# EAGLE design 8bitPig-PigstyGates_v2-mainPCB (EAGLE 9.2.2)
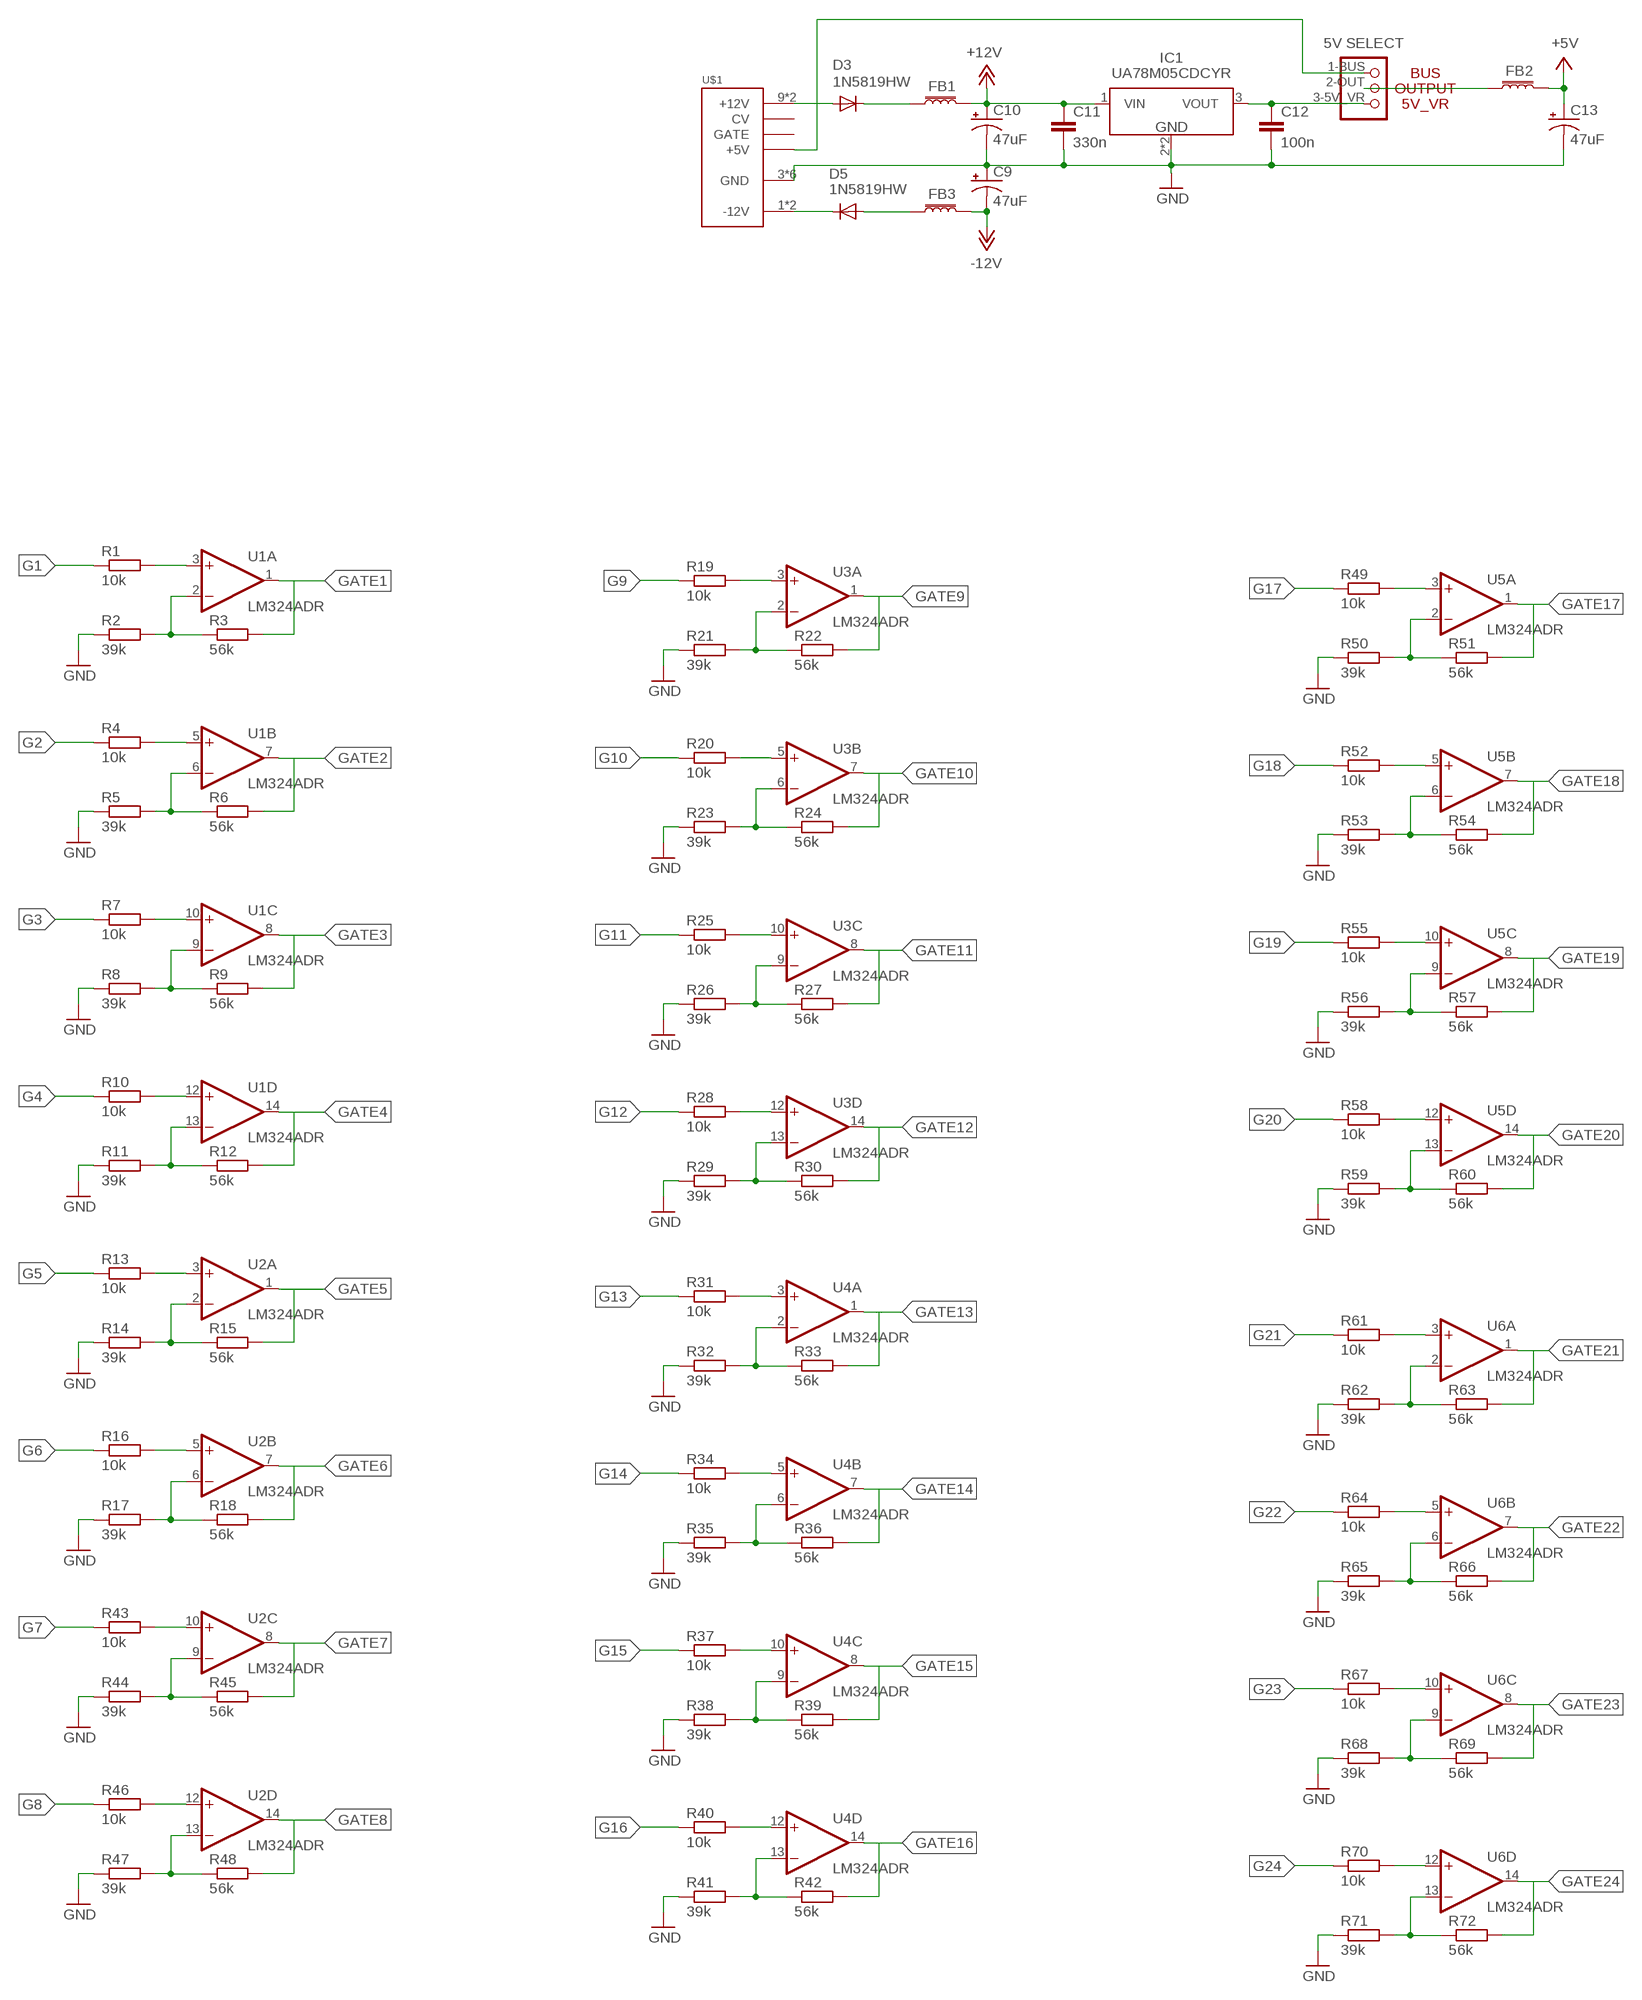
[diagram p0: schematic, sheet 1, part 1 of 2]
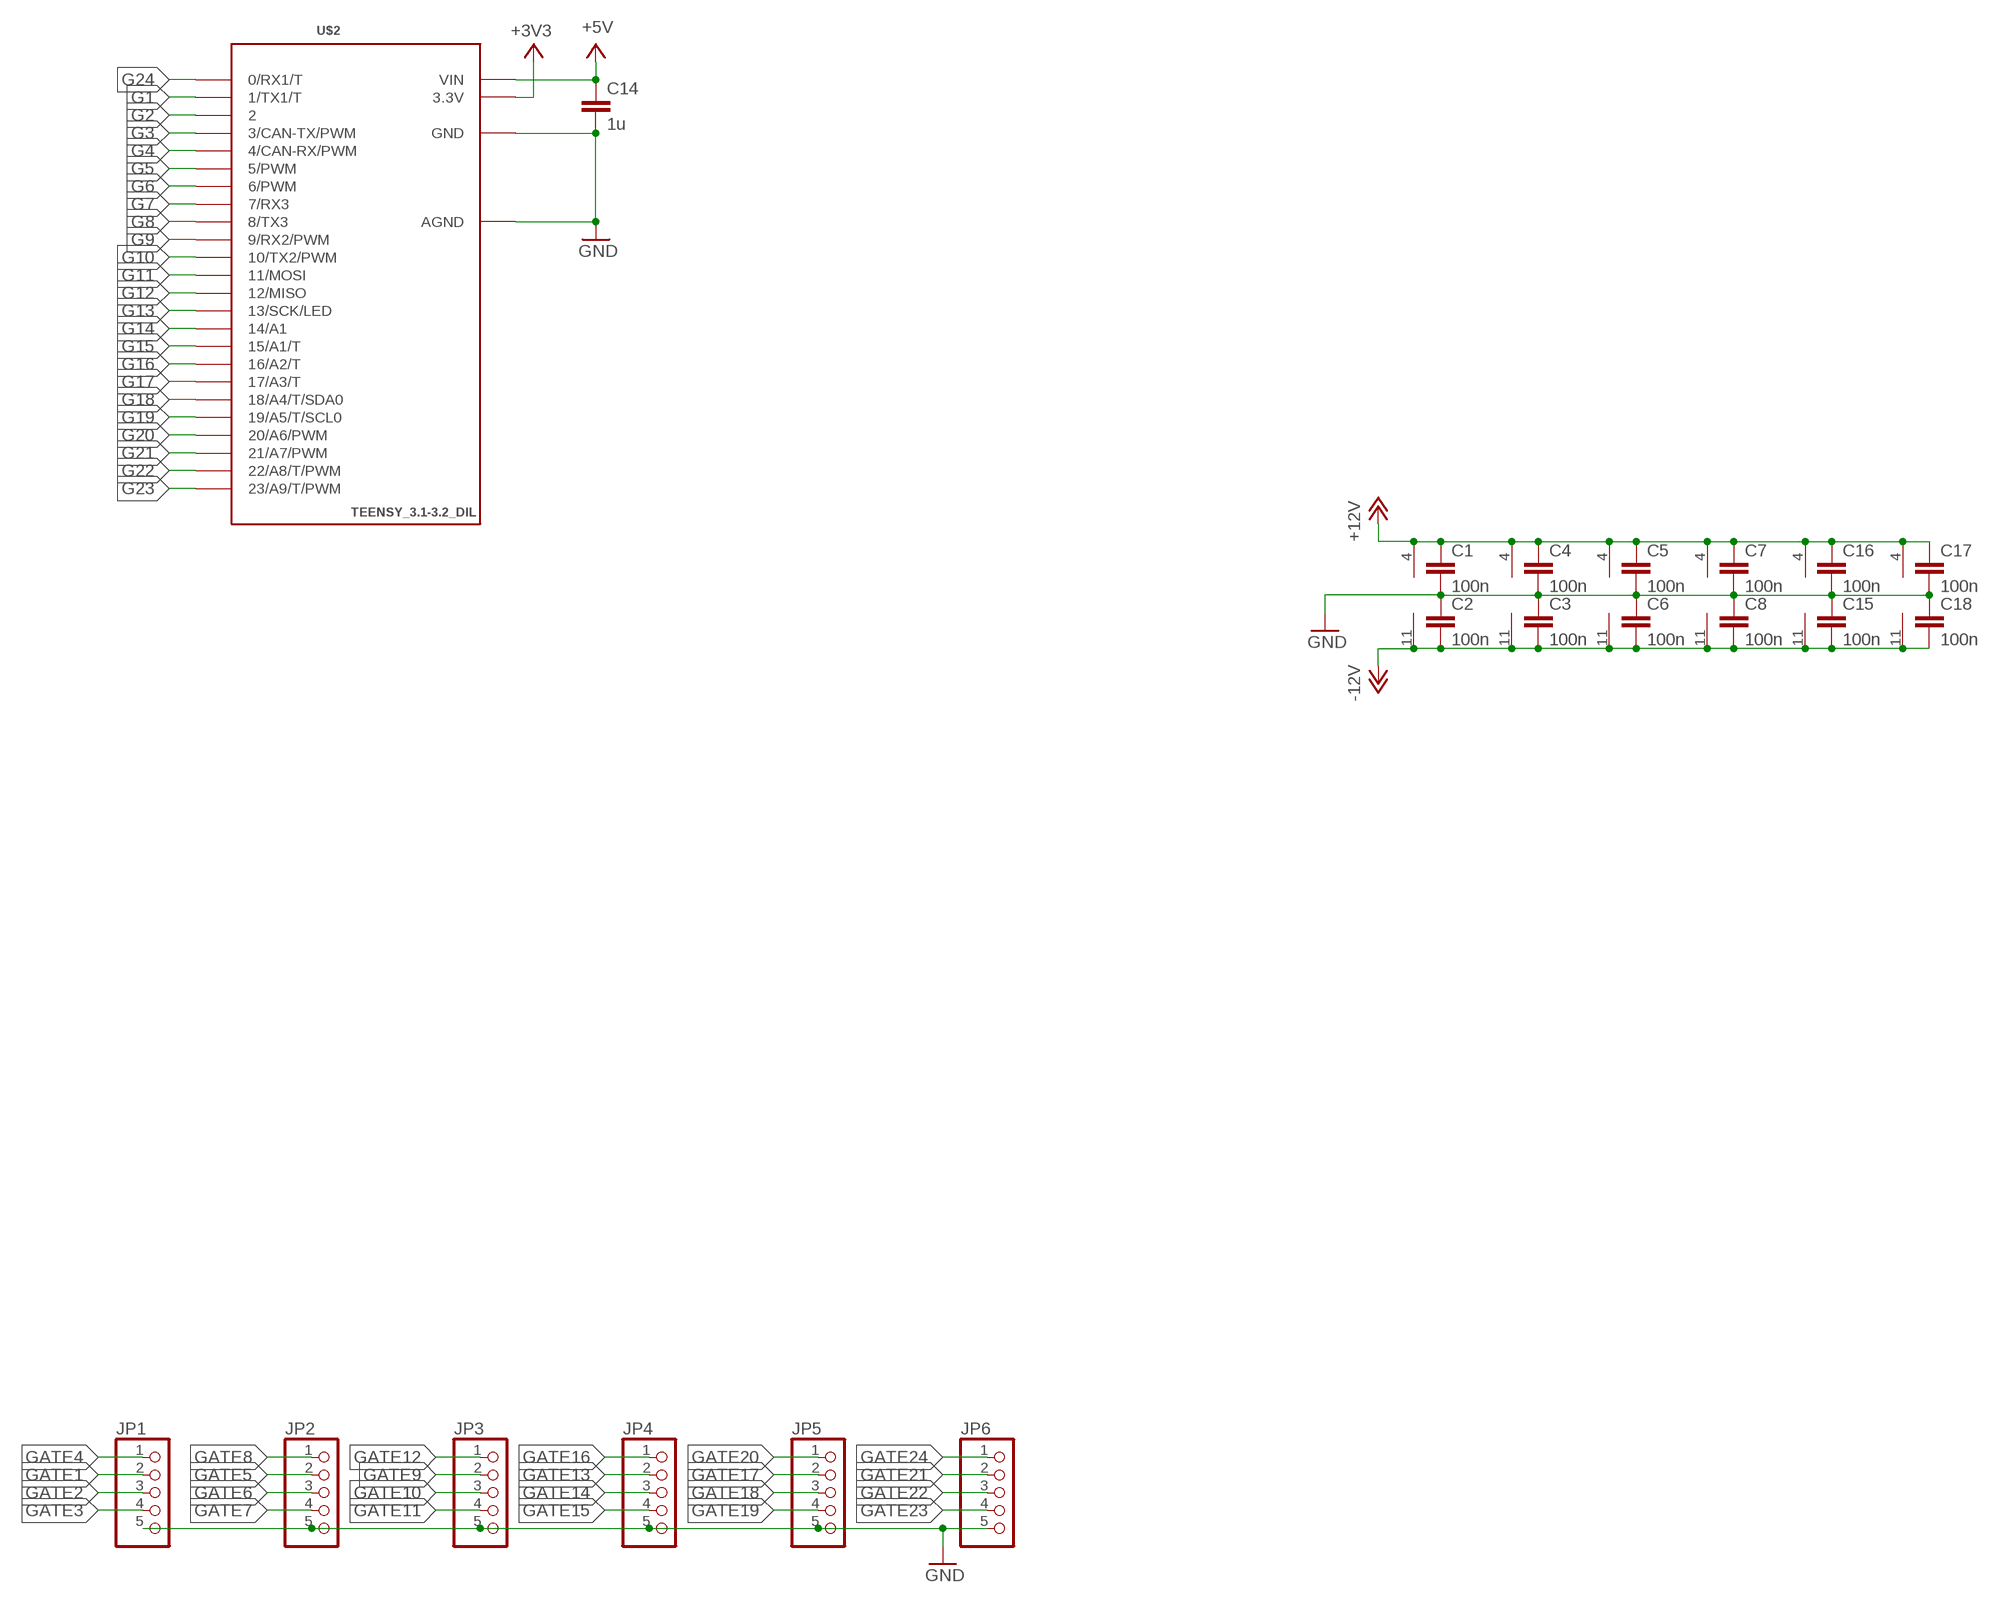
[diagram p1: schematic, sheet 1, part 2 of 2]

## Parts
C1  100n  C-EUC0603  [C0603]
C2  100n  C-EUC0603  [C0603]
C3  100n  C-EUC0603  [C0603]
C4  100n  C-EUC0603  [C0603]
C5  100n  C-EUC0603  [C0603]
C6  100n  C-EUC0603  [C0603]
C7  100n  C-EUC0603  [C0603]
C8  100n  C-EUC0603  [C0603]
C9  47uF  47UF-POLAR-PANASONIC_D-35V-20%  [PANASONIC_D]
C10  47uF  47UF-POLAR-PANASONIC_D-35V-20%  [PANASONIC_D]
C11  330n  C-EUC0603  [C0603]
C12  100n  C-EUC0603  [C0603]
C13  47uF  47UF-POLAR-PANASONIC_D-35V-20%  [PANASONIC_D]
C14  1u  C-EUC0603  [C0603]
C15  100n  C-EUC0603  [C0603]
C16  100n  C-EUC0603  [C0603]
C17  100n  C-EUC0603  [C0603]
C18  100n  C-EUC0603  [C0603]
D3  1N5819HW  DIODE_DIODE-SOD123  [DIODE_SOD123]
D5  1N5819HW  DIODE_DIODE-SOD123  [DIODE_SOD123]
FB1  30Ω/1.8A  FERRITE_BEAD-0603  [0603]
FB2  30Ω/1.8A  FERRITE_BEAD-0603  [0603]
FB3  30Ω/1.8A  FERRITE_BEAD-0603  [0603]
IC1  UA78M05CDCYR  [SOT230P700X180-4N]
JP1  PINHD-1X5  [1X05]
JP2  PINHD-1X5  [1X05]
JP3  PINHD-1X5  [1X05]
JP4  PINHD-1X5  [1X05]
JP5  PINHD-1X5  [1X05]
JP6  PINHD-1X5  [1X05]
JP_5V  SELECTOR_POWER  [SELECTOR_POWER]
R1  10k  R-EU_R0603  [R0603]
R2  39k  R-EU_R0603  [R0603]
R3  56k  R-EU_R0603  [R0603]
R4  10k  R-EU_R0603  [R0603]
R5  39k  R-EU_R0603  [R0603]
R6  56k  R-EU_R0603  [R0603]
R7  10k  R-EU_R0603  [R0603]
R8  39k  R-EU_R0603  [R0603]
R9  56k  R-EU_R0603  [R0603]
R10  10k  R-EU_R0603  [R0603]
R11  39k  R-EU_R0603  [R0603]
R12  56k  R-EU_R0603  [R0603]
R13  10k  R-EU_R0603  [R0603]
R14  39k  R-EU_R0603  [R0603]
R15  56k  R-EU_R0603  [R0603]
R16  10k  R-EU_R0603  [R0603]
R17  39k  R-EU_R0603  [R0603]
R18  56k  R-EU_R0603  [R0603]
R19  10k  R-EU_R0603  [R0603]
R20  10k  R-EU_R0603  [R0603]
R21  39k  R-EU_R0603  [R0603]
R22  56k  R-EU_R0603  [R0603]
R23  39k  R-EU_R0603  [R0603]
R24  56k  R-EU_R0603  [R0603]
R25  10k  R-EU_R0603  [R0603]
R26  39k  R-EU_R0603  [R0603]
R27  56k  R-EU_R0603  [R0603]
R28  10k  R-EU_R0603  [R0603]
R29  39k  R-EU_R0603  [R0603]
R30  56k  R-EU_R0603  [R0603]
R31  10k  R-EU_R0603  [R0603]
R32  39k  R-EU_R0603  [R0603]
R33  56k  R-EU_R0603  [R0603]
R34  10k  R-EU_R0603  [R0603]
R35  39k  R-EU_R0603  [R0603]
R36  56k  R-EU_R0603  [R0603]
R37  10k  R-EU_R0603  [R0603]
R38  39k  R-EU_R0603  [R0603]
R39  56k  R-EU_R0603  [R0603]
R40  10k  R-EU_R0603  [R0603]
R41  39k  R-EU_R0603  [R0603]
R42  56k  R-EU_R0603  [R0603]
R43  10k  R-EU_R0603  [R0603]
R44  39k  R-EU_R0603  [R0603]
R45  56k  R-EU_R0603  [R0603]
R46  10k  R-EU_R0603  [R0603]
R47  39k  R-EU_R0603  [R0603]
R48  56k  R-EU_R0603  [R0603]
R49  10k  R-EU_R0603  [R0603]
R50  39k  R-EU_R0603  [R0603]
R51  56k  R-EU_R0603  [R0603]
R52  10k  R-EU_R0603  [R0603]
R53  39k  R-EU_R0603  [R0603]
R54  56k  R-EU_R0603  [R0603]
R55  10k  R-EU_R0603  [R0603]
R56  39k  R-EU_R0603  [R0603]
R57  56k  R-EU_R0603  [R0603]
R58  10k  R-EU_R0603  [R0603]
R59  39k  R-EU_R0603  [R0603]
R60  56k  R-EU_R0603  [R0603]
R61  10k  R-EU_R0603  [R0603]
R62  39k  R-EU_R0603  [R0603]
R63  56k  R-EU_R0603  [R0603]
R64  10k  R-EU_R0603  [R0603]
R65  39k  R-EU_R0603  [R0603]
R66  56k  R-EU_R0603  [R0603]
R67  10k  R-EU_R0603  [R0603]
R68  39k  R-EU_R0603  [R0603]
R69  56k  R-EU_R0603  [R0603]
R70  10k  R-EU_R0603  [R0603]
R71  39k  R-EU_R0603  [R0603]
R72  56k  R-EU_R0603  [R0603]
U1  LM324ADR  TL074_SMD  [SO14]
U2  LM324ADR  TL074_SMD  [SO14]
U3  LM324ADR  TL074_SMD  [SO14]
U4  LM324ADR  TL074_SMD  [SO14]
U5  LM324ADR  TL074_SMD  [SO14]
U6  LM324ADR  TL074_SMD  [SO14]
U$1  POWER  [POWER_16]
U$2  TEENSY_3.1-3.2_DIL  [TEENSY_3.0-3.2&LC_DIL]

## Nets
+3V3: U$2.3.3V
+5V [pwr]: C13.+ C14.1 FB2.2 U$2.VIN
+12V [pwr]: C1.1 C4.1 C5.1 C7.1 C10.+ C11.1 C16.1 C17.1 FB1.2 IC1.1(VIN) U1.4(P:V+) U2.4(P:V+) U3.4(P:V+) U4.4(P:V+) U5.4(P:V+) U6.4(P:V+)
-12V [pwr]: C2.2 C3.2 C6.2 C8.2 C9.- C15.2 C18.2 FB3.2 U1.11(P:V-) U2.11(P:V-) U3.11(P:V-) U4.11(P:V-) U5.11(P:V-) U6.11(P:V-)
G1: R1.1 U$2.1(1/TX1/T)
G2: R4.1 U$2.2
G3: R7.1 U$2.3(3/CAN-TX/PWM)
G4: R10.1 U$2.4(4/CAN-RX/PWM)
G5: R13.1 U$2.5(5/PWM)
G6: R16.1 U$2.6(6/PWM)
G7: R43.1 U$2.7(7/RX3)
G8: R46.1 U$2.8(8/TX3)
G9: R19.1 U$2.9(9/RX2/PWM)
G10: R20.1 U$2.10(10/TX2/PWM)
G11: R25.1 U$2.11(11/MOSI)
G12: R28.1 U$2.12(12/MISO)
G13: R31.1 U$2.13(13/SCK/LED)
G14: R34.1 U$2.14/A0(14/A1)
G15: R37.1 U$2.15/A1(15/A1/T)
G16: R40.1 U$2.16/A2(16/A2/T)
G17: R49.1 U$2.17/A3(17/A3/T)
G18: R52.1 U$2.18/A4(18/A4/T/SDA0)
G19: R55.1 U$2.19/A5(19/A5/T/SCL0)
G20: R58.1 U$2.20/A6(20/A6/PWM)
G21: R61.1 U$2.21/A7(21/A7/PWM)
G22: R64.1 U$2.22/A8(22/A8/T/PWM)
G23: R67.1 U$2.23/A9(23/A9/T/PWM)
G24: R70.1 U$2.0(0/RX1/T)
GATE1: JP1.2 R3.2 U1.1(A:OUT)
GATE2: JP1.3 R6.2 U1.7(B:OUT)
GATE3: JP1.4 R9.2 U1.8(C:OUT)
GATE4: JP1.1 R12.2 U1.14(D:OUT)
GATE5: JP2.2 R15.2 U2.1(A:OUT)
GATE6: JP2.3 R18.2 U2.7(B:OUT)
GATE7: JP2.4 R45.2 U2.8(C:OUT)
GATE8: JP2.1 R48.2 U2.14(D:OUT)
GATE9: JP3.2 R22.2 U3.1(A:OUT)
GATE10: JP3.3 R24.2 U3.7(B:OUT)
GATE11: JP3.4 R27.2 U3.8(C:OUT)
GATE12: JP3.1 R30.2 U3.14(D:OUT)
GATE13: JP4.2 R33.2 U4.1(A:OUT)
GATE14: JP4.3 R36.2 U4.7(B:OUT)
GATE15: JP4.4 R39.2 U4.8(C:OUT)
GATE16: JP4.1 R42.2 U4.14(D:OUT)
GATE17: JP5.2 R51.2 U5.1(A:OUT)
GATE18: JP5.3 R54.2 U5.7(B:OUT)
GATE19: JP5.4 R57.2 U5.8(C:OUT)
GATE20: JP5.1 R60.2 U5.14(D:OUT)
GATE21: JP6.2 R63.2 U6.1(A:OUT)
GATE22: JP6.3 R66.2 U6.7(B:OUT)
GATE23: JP6.4 R69.2 U6.8(C:OUT)
GATE24: JP6.1 R72.2 U6.14(D:OUT)
GND [pwr]: C1.2 C2.1 C3.1 C4.2 C5.2 C6.1 C7.2 C8.1 C9.+ C10.- C11.2 C12.2 C13.- C14.2 C15.1 C16.2 C17.2 C18.1 IC1.2(GND) IC1.4(GND) JP1.5 JP2.5 JP3.5 JP4.5 JP5.5 JP6.5 R2.1 R5.1 R8.1 R11.1 R14.1 R17.1 R21.1 R23.1 R26.1 R29.1 R32.1 R35.1 R38.1 R41.1 R44.1 R47.1 R50.1 R53.1 R56.1 R59.1 R62.1 R65.1 R68.1 R71.1 U$1.3(GND) U$1.4(GND) U$1.5(GND) U$1.6(GND) U$1.7(GND) U$1.8(GND) U$2.AGND U$2.GND
N$1: R1.2 U1.3(A:+IN)
N$2: R2.2 R3.1 U1.2(A:-IN)
N$3: R4.2 U1.5(B:+IN)
N$4: R5.2 R6.1 U1.6(B:-IN)
N$5: R7.2 U1.10(C:+IN)
N$6: R8.2 R9.1 U1.9(C:-IN)
N$7: R10.2 U1.12(D:+IN)
N$8: R11.2 R12.1 U1.13(D:-IN)
N$9: D3.A U$1.9(+12V) U$1.10(+12V)
N$10: D5.C U$1.1(-12V) U$1.2(-12V)
N$11: D5.A FB3.1
N$12: D3.C FB1.1
N$13: JP_5V.1-BUS U$1.11(+5V) U$1.12(+5V)
N$14: C12.1 IC1.3(VOUT) JP_5V.3-5V_VR(3-VR)
N$15: FB2.1 JP_5V.2-OUT
N$16: R13.2 U2.3(A:+IN)
N$17: R19.2 U3.3(A:+IN)
N$18: R20.2 U3.5(B:+IN)
N$19: R21.2 R22.1 U3.2(A:-IN)
N$20: R23.2 R24.1 U3.6(B:-IN)
N$21: R25.2 U3.10(C:+IN)
N$22: R26.2 R27.1 U3.9(C:-IN)
N$23: R28.2 U3.12(D:+IN)
N$24: R29.2 R30.1 U3.13(D:-IN)
N$25: R31.2 U4.3(A:+IN)
N$26: R32.2 R33.1 U4.2(A:-IN)
N$27: R34.2 U4.5(B:+IN)
N$28: R35.2 R36.1 U4.6(B:-IN)
N$29: R37.2 U4.10(C:+IN)
N$30: R38.2 R39.1 U4.9(C:-IN)
N$31: R40.2 U4.12(D:+IN)
N$32: R41.2 R42.1 U4.13(D:-IN)
N$33: R14.2 R15.1 U2.2(A:-IN)
N$34: R16.2 U2.5(B:+IN)
N$35: R17.2 R18.1 U2.6(B:-IN)
N$36: R43.2 U2.10(C:+IN)
N$37: R44.2 R45.1 U2.9(C:-IN)
N$38: R46.2 U2.12(D:+IN)
N$39: R47.2 R48.1 U2.13(D:-IN)
N$40: R49.2 U5.3(A:+IN)
N$41: R50.2 R51.1 U5.2(A:-IN)
N$42: R52.2 U5.5(B:+IN)
N$43: R53.2 R54.1 U5.6(B:-IN)
N$44: R55.2 U5.10(C:+IN)
N$45: R56.2 R57.1 U5.9(C:-IN)
N$46: R58.2 U5.12(D:+IN)
N$47: R59.2 R60.1 U5.13(D:-IN)
N$48: R61.2 U6.3(A:+IN)
N$49: R62.2 R63.1 U6.2(A:-IN)
N$50: R64.2 U6.5(B:+IN)
N$51: R65.2 R66.1 U6.6(B:-IN)
N$52: R67.2 U6.10(C:+IN)
N$53: R68.2 R69.1 U6.9(C:-IN)
N$54: R70.2 U6.12(D:+IN)
N$55: R71.2 R72.1 U6.13(D:-IN)
Unconnected: U$1.13(CV) U$1.14(CV) U$1.15(GATE) U$1.16(GATE)

## Library data of the parts
C1-C8 C11 C12 C14-C18 = resistor:C-EU: CAPACITOR, European symbol
C9 C10 C13 = SparkFun-Capacitors:47UF-POLAR: 47µF polarized capacitors A capacitor is a passive two-terminal electrical component used to store electrical energy temporarily in an electric field.; PROD_ID: CAP-08478
D3 D5 = grids_v02:DIODE_DIODE-: DIODE
FB1-FB3 = SparkFun-Coils:FERRITE_BEAD: Ferrite Bead (blocks, cores, rings, chokes, etc.) Inductor with layers of ferrite used to suppress high frequencies. Often used to isolate high frequency noise. SparkFun Products: IOIO-OTG - V2.2 <https://www.sparkfun.com/products/13613> SparkFun SAMD21 Mini Breakout <https://www.sparkfun.com/products/13664> SparkFun 6 Degrees of Freedom Breakout - LSM6DS3 <https://www.sparkfun.com/products/13339> SparkFun SAMD21 Dev Breakout <https://www.sparkfun.com/products/13672>; PROD_ID: NDUC-07859
IC1 = SamacSys_Parts:UA78M05CDCYR: 500-mA, 25-V, Linear Voltage Regulators Source: Datasheet <http://www.ti.com/lit/gpn/ua78m>; DESCRIPTION: 500-mA, 25-V, Linear Voltage Regulators; HEIGHT: 1.8mm; MANUFACTURER_NAME: Texas Instruments; MANUFACTURER_PART_NUMBER: UA78M05CDCYR; MOUSER_PART_NUMBER: 595-UA78M05CDCYR; MOUSER_PRICE-STOCK: https://www.mouser.com/Search/Refine.aspx?Keyword=595-UA78M05CDCYR
JP1-JP6 = pinhead:PINHD-1X5: PIN HEADER
JP_5V = SchnitzelsComponents:SELECTOR_POWER: PIN HEADER
R1-R72 = resistor:R-EU_: RESISTOR, European symbol
U1-U6 = SchnitzelsComponents:TL074: Generic Quad Op Amp
U$1 = eurorack:POWER
U$2 = Teensy_3_and_LC_Series_Boards_v1.4:TEENSY_3.1-3.2_DIL: Teensy 3.1 or 3.2 in a DIL Layout.

## Net classes
0 default: width 0.152 mm, clearance 0.508 mm
1 pwr: width 0.305 mm, clearance 0.508 mm

## Board
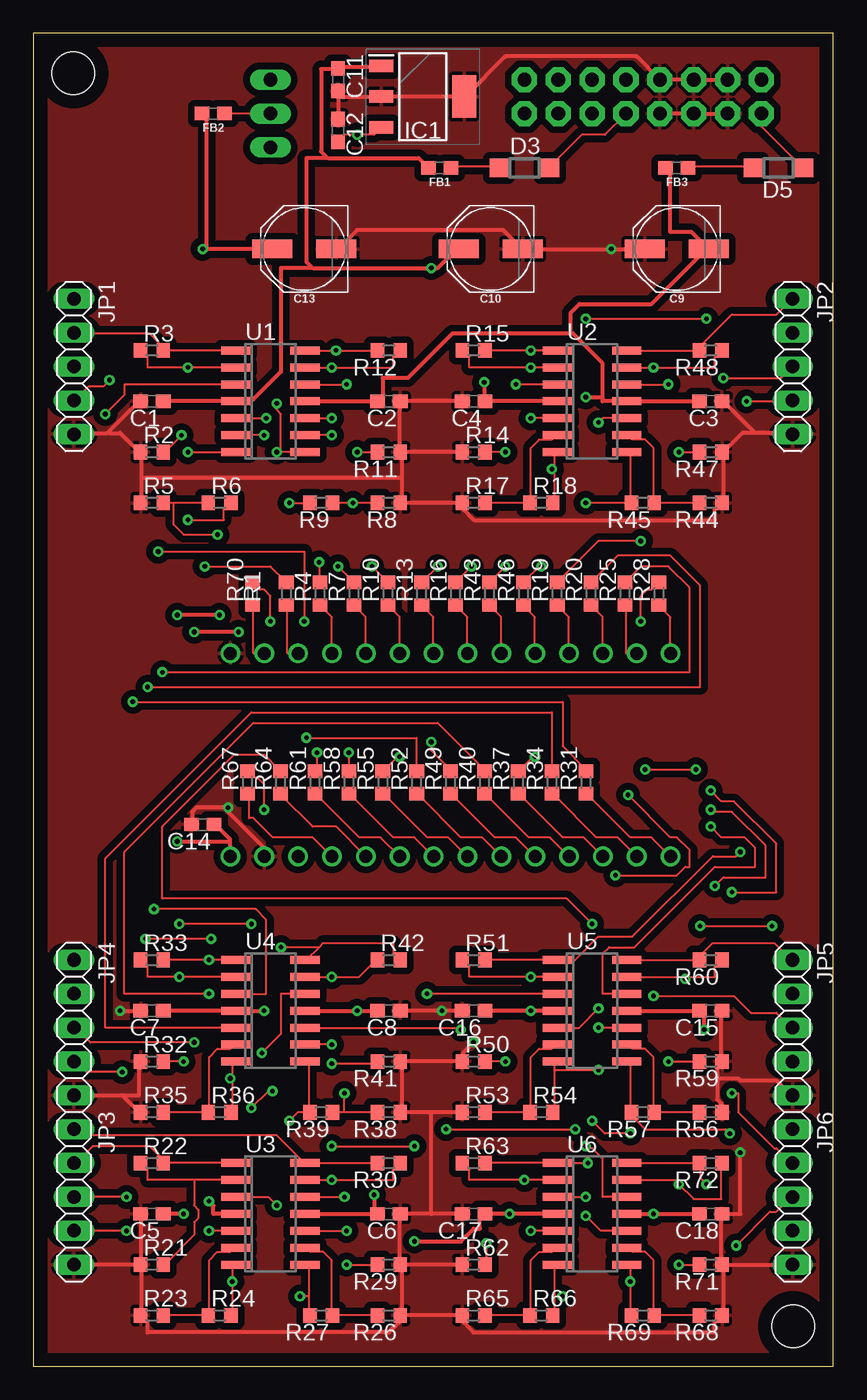
[diagram p2: board, top side]
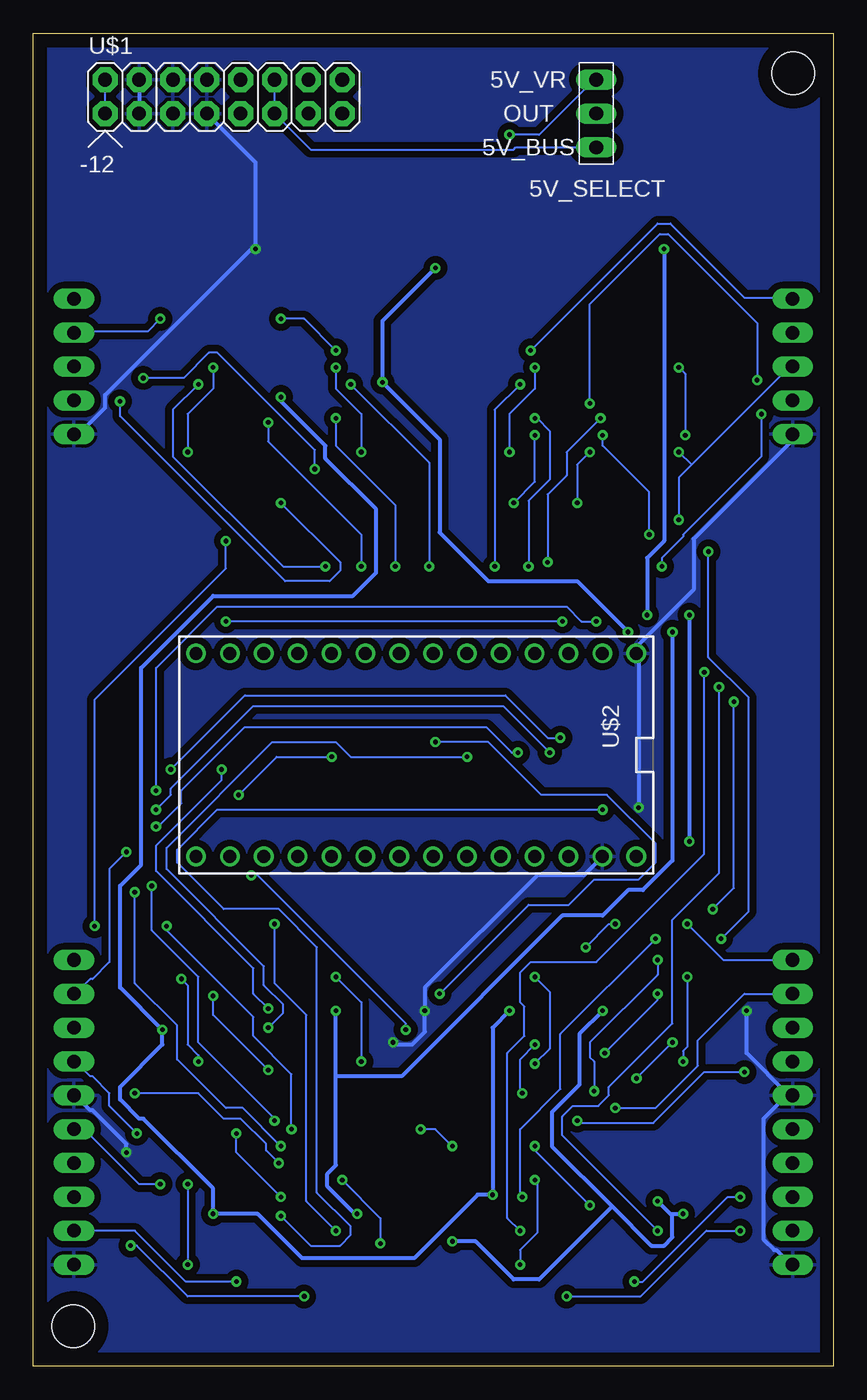
[diagram p3: board, bottom side, seen from below]

Size 60 x 100 mm. Coordinates in mm from the lower left corner, seen from the top.
Outline: 0,0 60,0 60,100 0,100 0,0
Copper layers (1*16): Top 0.035mm / dielectric 1.5mm / Bottom 0.035mm
Design rules "default": minimum track width 6mil, minimum drill 0.35mm, track to track 6mil, track to pad 6mil, pad to pad 6mil, via to via 6mil, smd to smd 6mil, copper to edge 40mil, drill to drill 6mil, minimum pad ring 10mil, minimum via ring 8mil, stop-mask expansion 4mil, vias tented up to drill 0mil, thermal gap 10mil
Holes 3.2 mm at 57,3 3,97

### Footprints (pad centres in the part's own frame; a part is rotated, then mirrored left to right if it is on the bottom)
C0603 = smd 1.1 x 1: 1 -0.85,0; 2 0.85,0
PANASONIC_D = smd 3 x 1.4: + 2.4,0; - -2.4,0
DIODE_SOD123 = smd 1.4 x 1.4: A 1.9,0; C -1.9,0
0603 = smd 1.1 x 1: 1 -0.85,0; 2 0.85,0
SOT230P700X180-4N = smd 1.8 x 0.95: 1 -3.1,2.3; 2 -3.1,0; 3 -3.1,-2.3 | smd 1.8 x 3.2: 4 3.1,0
1X05 = drill 1.016 long: 1 -5.08,0; 2 -2.54,0; 3 0,0; 4 2.54,0; 5 5.08,0
SELECTOR_POWER = drill 1.016 long: 1-BUS 0,5.08; 2-OUT 0,2.54; 3-5V_VR 0,0
R0603 = smd 1 x 1.1: 1 -0.85,0; 2 0.85,0
SO14 = smd 0.6 x 2.2: 1 -3.81,-2.6; 2 -2.54,-2.6; 3 -1.27,-2.6; 4 0,-2.6; 5 1.27,-2.6; 6 2.54,-2.6; 7 3.81,-2.6; 8 3.81,2.6; 9 2.54,2.6; 10 1.27,2.6; 11 0,2.6; 12 -1.27,2.6; 13 -2.54,2.6; 14 -3.81,2.6
POWER_16 = drill 1.016 pad 1.88 octagon: 1 -6.35,-1.27; 2 -6.35,1.27; 3 -3.81,-1.27; 4 -3.81,1.27; 5 -1.27,-1.27; 6 -1.27,1.27; 7 1.27,-1.27; 8 1.27,1.27; 9 3.81,-1.27; 10 3.81,1.27; 11 6.35,-1.27; 12 6.35,1.27; 13 8.89,-1.27; 14 8.89,1.27; 15 11.43,-1.27; 16 11.43,1.27
TEENSY_3.0-3.2&LC_DIL = drill 0.965: 0 -7.62,13.97; 1 -7.62,11.43; 2 -7.62,8.89; 3 -7.62,6.35; 3.3V 7.62,11.43; 4 -7.62,3.81; 5 -7.62,1.27; 6 -7.62,-1.27; 7 -7.62,-3.81; 8 -7.62,-6.35; 9 -7.62,-8.89; 10 -7.62,-11.43; 11 -7.62,-13.97; 12 -7.62,-16.51; 13 7.62,-16.51; 14/A0 7.62,-13.97; 15/A1 7.62,-11.43; 16/A2 7.62,-8.89; 17/A3 7.62,-6.35; 18/A4 7.62,-3.81; 19/A5 7.62,-1.27; 20/A6 7.62,1.27; 21/A7 7.62,3.81; 22/A8 7.62,6.35; 23/A9 7.62,8.89; AGND 7.62,13.97; GND -7.62,16.51; VIN 7.62,16.51

### Placement (x,y rotation side)
C1  8.89,72.39 180 top
C2  26.67,72.39 180 top
C3  50.8,72.39 180 top
C4  33.02,72.39 180 top
C5  8.89,11.43 180 top
C6  26.67,11.43 180 top
C7  8.89,26.67 180 top
C8  26.67,26.67 180 top
C9  48.26,83.82 180 top
C10  34.29,83.82 180 top
C11  22.86,96.52 270 top
C12  22.86,92.71 90 top
C13  20.32,83.82 180 top
C14  12.7,40.64 180 top
C15  50.8,26.67 180 top
C16  33.02,26.67 180 top
C17  33.02,11.43 180 top
C18  50.8,11.43 180 top
D3  36.83,89.9 0 top
D5  55.88,89.9 180 top
FB1  30.48,89.9 180 top
FB2  13.49,93.98 180 top
FB3  48.26,89.9 180 top
IC1  29.21,95.25 0 top
JP1  3.05,75 270 top
JP2  56.95,75 270 top
JP3  3.05,12.7 270 top
JP4  3.05,25.4 270 top
JP5  56.95,25.4 270 top
JP6  56.95,12.7 270 top
JP_5V  17.78,96.52 180 bottom
R1  18.97,57.96 90 top
R2  8.89,68.58 0 top
R3  8.89,76.2 0 top
R4  21.51,57.96 90 top
R5  8.89,64.77 0 top
R6  13.97,64.77 0 top
R7  24.05,57.96 90 top
R8  26.67,64.77 180 top
R9  21.59,64.77 180 top
R10  26.59,57.96 90 top
R11  26.67,68.58 180 top
R12  26.67,76.2 180 top
R13  29.13,57.96 90 top
R14  33.02,68.58 0 top
R15  33.02,76.2 0 top
R16  31.67,57.96 90 top
R17  33.02,64.77 0 top
R18  38.1,64.77 0 top
R19  39.29,57.96 90 top
R20  41.83,57.96 90 top
R21  8.89,7.62 0 top
R22  8.89,15.24 0 top
R23  8.89,3.81 0 top
R24  13.97,3.81 0 top
R25  44.37,57.96 90 top
R26  26.67,3.81 180 top
R27  21.59,3.81 180 top
R28  46.91,57.96 90 top
R29  26.67,7.62 180 top
R30  26.67,15.24 180 top
R31  41.45,43.8 90 top
R32  8.89,22.86 0 top
R33  8.89,30.48 0 top
R34  38.91,43.8 90 top
R35  8.89,19.05 0 top
R36  13.97,19.05 0 top
R37  36.37,43.8 90 top
R38  26.67,19.05 180 top
R39  21.59,19.05 180 top
R40  33.83,43.8 90 top
R41  26.67,22.86 180 top
R42  26.67,30.48 0 top
R43  34.21,57.96 90 top
R44  50.8,64.77 180 top
R45  45.72,64.77 180 top
R46  36.75,57.96 90 top
R47  50.8,68.58 180 top
R48  50.8,76.2 180 top
R49  31.29,43.8 90 top
R50  33.02,22.86 0 top
R51  33.02,30.48 0 top
R52  28.75,43.8 90 top
R53  33.02,19.05 0 top
R54  38.1,19.05 0 top
R55  26.21,43.8 90 top
R56  50.8,19.05 180 top
R57  45.72,19.05 180 top
R58  23.67,43.8 90 top
R59  50.8,22.86 180 top
R60  50.8,30.48 180 top
R61  21.13,43.8 90 top
R62  33.02,7.62 0 top
R63  33.02,15.24 0 top
R64  18.54,43.8 90 top
R65  33.02,3.81 0 top
R66  38.1,3.81 0 top
R67  16.05,43.8 90 top
R68  50.8,3.81 180 top
R69  45.72,3.81 180 top
R70  16.43,57.96 90 top
R71  50.8,7.62 180 top
R72  50.8,15.24 180 top
U1  17.78,72.39 270 top
U2  41.91,72.39 270 top
U3  17.78,11.43 270 top
U4  17.78,26.67 270 top
U5  41.91,26.67 270 top
U6  41.91,11.43 270 top
U$1  48.26,95.25 0 bottom
U$2  31.29,45.86 270 bottom

### Tracks (layer width: path | path; a pad name or v marks a point on that pad's centre or on a via)
+5V  (via drill 0.35)
  Top 0.305: 14.76,39.37 14.76,38.26 U$2.VIN | 14.76,39.37 14.76,39.53 13.65,40.64 C14.1 | 13.02,83.82 13.02,93.66 12.7,93.98 FB2.2 | C13.+ 13.02,83.82 | v10.79,39.37 14.76,39.37 | v13.97,56.36 v10.79,56.36 | 13.02,83.82 v12.7,83.82
  Bottom 0.305: v10.79,56.36 v10.79,39.37 | v13.97,56.36 13.97,60.64 12.7,61.91 v12.7,83.82
+12V  (via drill 0.35)
  Top 0.305: U5.4 v37.31,26.67 C16.1 | U6.4 v35.72,11.43 C17.1 33.81,11.43 33.5,11.11 33.5,10.32 33.02,10.32 32.07,9.37 v28.57,9.37 | v11.27,11.43 C5.1 | v13.18,12.38 13.49,12.06 13.49,11.43 U3.4 | C7.1 U4.4 v17.3,26.67 | U2.4 C4.1 33.81,72.39 v33.81,73.82 | C1.1 U1.4 15.24,72.39 15.4,72.55 16.51,72.55 18.57,74.61 18.57,82.39 20.8,82.39 20.88,82.47 | IC1.1 26.04,97.47 22.86,97.47 C11.1 22.86,97.31 21.59,97.31 21.59,91.12 21.99,90.73 | 21.99,90.73 22.07,90.65 28.89,90.65 29.53,90.01 FB1.2 | 20.88,82.47 20.48,82.87 20.48,90.65 21.91,90.65 21.99,90.73 | 20.88,82.47 20.95,82.39 v29.84,82.39 30.32,82.39 31.75,83.82 C10.+ | v15.4,55.09 v12.06,55.09
  Bottom 0.305: 12.06,11.43 12.22,11.43 v13.18,12.38 | 12.06,11.43 v11.27,11.43 | 12.06,11.43 12.06,9.68 12.7,9.05 13.65,9.05 16.59,11.99 | 16.59,11.99 21.11,16.51 21.11,19.05 19.05,21.11 19.05,24.92 v17.3,26.67 | v28.57,9.37 26.83,9.37 23.97,6.51 22.07,6.51 16.59,11.99 | 37.31,21.75 37.31,15.08 37.94,14.45 37.94,13.49 35.88,11.43 v35.72,11.43 | 37.31,21.75 v37.31,26.67 | v29.84,82.39 33.81,78.42 v33.81,73.82 29.53,69.53 29.53,62.55 25.88,58.9 19.21,58.9 v15.4,55.09 | 37.31,21.75 32.38,21.75 20.32,33.81 17.3,33.81 15.4,35.72 14.29,35.72 12.06,37.94 v12.06,55.09
-12V  (via drill 0.35)
  Top 0.305: FB3.2 47.47,89.85 47.78,89.53 47.78,85.09 49.37,85.09 50.64,83.82 C9.- 50.48,83.82 46.35,79.69 40.96,79.69 40.32,79.06 40.32,77.47 | U1.11 C2.2 25.88,72.39 26.19,72.71 26.19,74.14 28.1,74.14 31.43,77.47 40.32,77.47 | C3.2 U2.11 42.7,72.39 42.7,72.71 | 40.32,77.47 40.48,77.47 42.7,75.25 42.7,72.71 | U5.11 C15.2 50.01,26.67 50.32,26.35 v50.32,25.24 | U6.11 v46.51,11.43 C18.2 | U3.11 25.56,11.43 | 25.56,11.43 C6.2 25.72,11.43 | U4.11 v24.29,26.67 C8.2 | v25.56,12.86 25.56,11.43 | v41.43,72.71 42.7,72.71
  Bottom 0.305: v24.29,26.67 25.56,25.4 v25.56,12.86 26.67,12.86 31.43,8.1 39.85,8.1 43.18,11.43 v46.51,11.43 46.51,13.34 51.75,18.57 52.07,18.57 53.5,20 53.5,20.95 50.32,24.13 v50.32,25.24 53.5,28.42 53.5,36.04 51.91,37.62 51.91,52.39 46.51,57.78 36.04,57.78 34.29,59.53 34.29,64.29 38.1,68.1 38.1,69.06 41.43,72.39 v41.43,72.71
G1
  Top 0.152: R1.1 19.05,56.99 19.05,53.5 19.84,53.5 U$2.1
G2
  Top 0.152: R4.1 21.59,56.99 22.38,56.2 22.38,53.5 U$2.2
G3
  Top 0.152: R7.1 24.13,56.99 24.92,56.2 24.92,53.5 U$2.3
G4
  Top 0.152: R10.1 26.67,56.99 27.46,56.2 27.46,53.5 U$2.4
G5
  Top 0.152: R13.1 29.21,56.99 30,56.2 30,53.5 U$2.5
G6
  Top 0.152: R16.1 31.75,56.99 32.54,56.2 32.54,53.5 U$2.6
G7
  Top 0.152: R43.1 34.29,56.99 35.08,56.2 35.08,53.5 U$2.7
G8
  Top 0.152: R46.1 36.83,56.99 37.62,56.2 37.62,53.5 U$2.8
G9
  Top 0.152: R19.1 39.37,56.99 40.16,56.2 40.16,53.5 U$2.9
G10
  Top 0.152: R20.1 41.91,56.99 42.7,56.2 42.7,53.5 U$2.10
G11
  Top 0.152: R25.1 44.45,56.99 44.45,53.5 45.24,53.5 U$2.11
G12
  Top 0.152: R28.1 46.99,56.99 47.78,56.2 47.78,53.5 U$2.12
G13
  Top 0.152: R31.1 41.59,42.86 44.77,39.69 46.35,39.69 47.78,38.26 U$2.13
G14
  Top 0.152: R34.1 39.05,42.86 42.23,39.69 43.81,39.69 45.24,38.26 U$2.14/A0
G15
  Top 0.152: R37.1 36.51,42.86 39.69,39.69 41.27,39.69 42.7,38.26 U$2.15/A1
G16
  Top 0.152: R40.1 33.97,42.86 37.15,39.69 38.73,39.69 40.16,38.26 U$2.16/A2
G17
  Top 0.152: R49.1 31.43,42.86 34.61,39.69 36.2,39.69 37.62,38.26 U$2.17/A3
G18
  Top 0.152: R52.1 28.89,42.86 32.07,39.69 33.66,39.69 35.08,38.26 U$2.18/A4
G19
  Top 0.152: R55.1 26.35,42.86 29.53,39.69 31.11,39.69 32.54,38.26 U$2.19/A5
G20
  Top 0.152: R58.1 23.81,42.86 26.99,39.69 28.57,39.69 30,38.26 U$2.20/A6
G21
  Top 0.152: R61.1 21.27,42.86 24.45,39.69 26.04,39.69 27.46,38.26 U$2.21/A7
G22
  Top 0.152: R64.1 18.57,42.86 20.95,40.48 22.7,40.48 24.92,38.26 U$2.22/A8
G23
  Top 0.152: R67.1 16.19,42.86 16.19,41.12 16.51,41.12 17.94,39.69 20.95,39.69 22.38,38.26 U$2.23/A9
G24
  Top 0.152: R70.1 16.51,56.99 16.51,53.5 17.3,53.5 U$2.0
GATE1
  Top 0.152: U1.1 10,76.2 | 10,76.2 R3.2 9.84,76.2 | 10,76.2 8.73,77.47 3.17,77.47 JP1.2
GATE2  (via drill 0.35)
  Top 0.152: v11.59,63.5 14.29,63.5 14.29,64.29 14.76,64.77 R6.2 | v11.59,68.58 U1.7
  Bottom 0.152: v11.59,63.5 11.59,66.67 10.64,67.63 | 10.64,67.63 3.17,75.09 JP1.3 | 10.64,67.63 v11.59,68.58
GATE3  (via drill 0.35)
  Top 0.152: v19.21,64.77 R9.2 | U1.8 18.57,68.58 | v5.71,73.98 5.24,73.5 4.13,73.5 3.17,72.55 JP1.4 | v18.26,72.23 18.26,71.75 18.57,71.44 18.57,68.58 | 18.57,68.58 v18.26,68.58
  Bottom 0.152: v19.21,64.77 19.21,67.63 v18.26,68.58 | v5.71,73.98 5.71,78.26 12.38,84.93 13.02,84.93 18.26,79.69 v18.26,72.23
GATE4  (via drill 0.35)
  Top 0.152: U1.14 v22.7,76.2 R12.2
  Bottom 0.152: v22.7,76.2 13.18,85.72 12.22,85.72 6.67,80.17 3.17,80.17 JP1.1
GATE5  (via drill 0.35)
  Top 0.152: U2.1 v37.31,76.2 R15.2 | v41.43,78.58 v50.48,78.58
  Bottom 0.152: v50.48,78.58 51.44,77.63 56.83,77.63 JP2.2 | v41.43,78.58 39.69,78.58 v37.31,76.2
GATE6  (via drill 0.35)
  Top 0.152: 39.05,67.31 39.05,68.58 U2.7 | 39.05,67.31 39.05,64.77 R18.2 | v51.75,74.14 56.04,74.14 56.83,74.93 JP2.3 | 39.05,67.31 v38.89,67.31
  Bottom 0.152: v51.75,74.14 48.74,74.14 46.83,76.04 46.2,76.04 38.89,68.74 v38.89,67.31
GATE7  (via drill 0.35)
  Top 0.152: 44.77,64.77 44.77,68.58 U2.8 | v53.5,72.39 56.83,72.39 JP2.4 | 44.77,64.77 v41.43,64.77 | 44.77,64.77 R45.2
  Bottom 0.152: v53.5,72.39 53.5,71.28 41.12,58.9 37.78,58.9 36.99,59.69 36.99,60.33 v41.43,64.77
GATE8
  Top 0.152: U2.14 49.69,76.2 | 49.69,76.2 R48.2 49.85,76.2 | 49.69,76.2 52.39,78.9 55.72,78.9 56.83,80.01 JP2.1
GATE9
  Top 0.152: U3.1 10,15.24 | 10,15.24 R22.2 9.84,15.24 | 10,15.24 8.73,16.51 4.45,16.51 3.17,15.24 JP3.2
GATE10  (via drill 0.35)
  Top 0.152: U3.7 14.92,7.62 v14.92,6.35 14.92,3.81 R24.2 | v6.99,12.7 JP3.3
  Bottom 0.152: v6.99,12.7 7.94,12.7 14.29,6.35 v14.92,6.35
GATE11  (via drill 0.35)
  Top 0.152: 20.64,5.24 20.64,7.62 U3.8 | 20.64,5.24 20.64,3.81 R27.2 | v6.99,10.16 JP3.4 | 20.64,5.24 v20,5.24
  Bottom 0.152: v6.99,10.16 9.53,10.16 14.45,5.24 v20,5.24
GATE12
  Top 0.152: R30.2 U3.14 20.32,15.24 18.26,17.3 3.65,17.3 3.17,17.78 JP3.1
GATE13  (via drill 0.35)
  Top 0.152: U4.1 v13.18,30.48 R33.2 | v16.35,19.37 17.62,20.64 v17.94,20.64
  Bottom 0.152: JP4.2 6.67,27.94 10.16,24.45 10.16,22.54 13.34,19.37 v16.35,19.37 | v17.94,20.64 17.94,22.86 18.26,23.18 18.26,24.29 13.18,29.37 v13.18,30.48
GATE14  (via drill 0.35)
  Top 0.152: 14.92,21.59 14.92,22.86 U4.7 | 14.92,21.59 14.92,19.05 R36.2 | v12.06,24.29 4.29,24.29 3.17,25.4 JP4.3 | 14.92,21.59 v14.76,21.59
  Bottom 0.152: v14.76,21.59 v12.06,24.29
GATE15  (via drill 0.35)
  Top 0.152: 20.64,19.05 20.64,22.86 U4.8 | v6.67,22.07 3.97,22.07 3.17,22.86 JP4.4 | v19.21,18.41 19.84,19.05 20.64,19.05 | 20.64,19.05 R39.2
  Bottom 0.152: v6.67,22.07 9.68,22.07 13.49,18.26 19.05,18.26 v19.21,18.41
GATE16  (via drill 0.35)
  Top 0.152: 21.43,31.43 20.48,30.48 U4.14 | 21.43,31.43 21.75,31.75 26.99,31.75 26.99,30.96 27.46,30.48 R42.2 | v16.35,33.18 v10.95,33.18 | 21.43,31.43 v18.57,31.43
  Bottom 0.152: JP4.1 8.26,30.48 v10.95,33.18 | v16.35,33.18 16.83,33.18 v18.57,31.43
GATE17  (via drill 0.35)
  Top 0.152: R51.2 U5.1 40.64,30.48 42.39,32.23 44.93,32.23 50.96,38.26 52.7,38.26 v53.02,38.58
  Bottom 0.152: v53.02,38.58 54.29,37.31 54.29,30.32 55.56,29.05 55.72,29.05 56.83,27.94 JP5.2
GATE18  (via drill 0.35)
  Top 0.152: 39.05,22.23 39.05,22.86 U5.7 | 39.05,22.23 39.05,19.05 R54.2 | v46.51,27.78 52.55,27.78 53.82,26.51 55.72,26.51 56.83,25.4 JP5.3 | 39.05,22.23 v42.39,22.23
  Bottom 0.152: v46.51,27.78 46.51,26.35 v42.39,22.23
GATE19  (via drill 0.35)
  Top 0.152: U5.8 44.77,22.86 44.77,19.05 R57.2 44.93,19.05 44.93,18.73 45.88,17.78 51.91,17.78 v52.23,17.46
  Bottom 0.152: v52.23,17.46 54.29,19.53 54.29,20.48 55.56,21.75 55.72,21.75 56.83,22.86 JP5.4
GATE20
  Top 0.152: U5.14 49.69,30.48 | 49.69,30.48 R60.2 49.85,30.48 | 49.69,30.48 50.96,31.75 55.56,31.75 56.83,30.48 JP5.1
GATE21  (via drill 0.35)
  Top 0.152: R63.2 U6.1 v41.59,15.24 | v52.39,20.48 52.86,20.48 52.86,19.05 55.56,16.35 55.72,16.35 56.83,15.24 JP6.2
  Bottom 0.152: v52.39,20.48 47.62,20.48 45.72,18.57 44.45,18.57 42.55,16.67 42.55,16.19 v41.59,15.24
GATE22  (via drill 0.35)
  Top 0.152: 39.05,5.24 39.05,7.62 U6.7 | 39.05,5.24 39.05,3.81 R66.2 | v52.7,9.05 55.24,11.59 55.72,11.59 56.83,12.7 JP6.3 | 39.05,5.24 v39.69,5.24
  Bottom 0.152: v52.7,9.05 52.23,9.05 48.42,5.24 v39.69,5.24
GATE23  (via drill 0.35)
  Top 0.152: U6.8 44.77,7.62 v44.77,6.35 44.77,3.81 R69.2
  Bottom 0.152: JP6.4 52.39,10.16 48.58,6.35 v44.77,6.35
GATE24  (via drill 0.35)
  Top 0.152: U6.14 R72.2 50.01,15.24 50.01,14.13 v50.48,13.65
  Bottom 0.152: JP6.1 56.2,17.78 52.07,13.65 v50.48,13.65
GND  (via drill 0.35)
  Top 0.305: C16.2 v30.64,26.67 C8.1 | 14.37,41.83 17.3,38.89 17.3,38.26 U$2.AGND | 14.37,41.83 14.29,41.91 12.22,41.91 11.91,41.59 11.91,40.64 C14.2 | 8.1,7.62 8.1,3.81 | 8.1,7.62 8.1,11.43 C5.2 | 8.1,7.62 R21.1 JP3.5 | 6.75,20.24 6.67,20.32 JP4.5 | 6.75,20.24 7.94,19.05 R35.1 | R32.1 7.94,22.86 7.94,20.32 6.83,20.32 6.75,20.24 | v6.51,26.67 C7.2 | 51.28,21.59 51.28,22.86 51.59,22.86 | 51.28,21.59 51.28,20 51.59,19.68 51.59,19.05 R56.1 | 51.59,22.86 51.59,26.67 C15.1 | 51.59,22.86 R59.1 | 51.28,21.59 52.86,21.59 53.02,21.43 55.72,21.43 56.83,20.32 JP5.5 | 51.75,7.62 51.75,3.81 R68.1 51.59,3.81 51.12,3.33 51.12,2.54 33.02,2.54 32.23,3.33 32.23,3.81 R65.1 27.62,3.81 | 51.75,7.62 JP6.5 | 51.75,7.62 R71.1 51.59,7.62 51.59,11.43 C18.1 53.02,11.43 v53.02,16.03 | R53.1 29.84,19.05 | 29.84,19.05 27.62,19.05 | 27.62,22.86 R50.1 32.23,22.86 32.23,23.5 v33.02,24.29 | 27.62,22.86 27.62,19.05 | 27.62,19.05 R38.1 | 27.62,22.86 R41.1 | C17.2 29.84,11.43 | 29.84,11.43 C6.1 27.46,11.43 27.46,7.62 R29.1 27.62,7.62 | R62.1 27.62,7.62 | 27.62,7.62 27.62,3.81 | 27.62,3.81 R26.1 27.46,3.81 27.46,3.33 26.67,2.54 8.57,2.54 8.57,3.33 8.1,3.81 | 29.84,11.43 29.84,19.05 | 8.1,3.81 R23.1 | C13.- 22.86,83.82 24.29,85.25 35.24,85.25 36.67,83.82 C10.- v43.34,83.82 C9.+ | 22.86,95.25 C11.2 22.86,95.57 | 22.86,95.25 C12.2 | 22.86,95.25 IC1.2 IC1.4 32.38,95.25 35.4,98.27 45.24,98.27 U$1.8 U$1.6 U$1.4 | U$1.7 U$1.5 U$1.3 | 51.75,68.58 51.75,64.77 R44.1 51.59,64.77 51.12,64.29 51.12,63.5 33.02,63.5 32.23,64.29 32.23,64.77 R17.1 27.62,64.77 | 54.05,70.09 54.13,70.01 56.83,70.01 JP2.5 | 54.05,70.09 51.75,72.39 C3.1 | 51.75,68.58 53.18,70.01 53.98,70.01 54.05,70.09
  Top 0.305: 51.75,68.58 R47.1 | C4.2 C2.1 27.46,72.39 27.46,68.58 R11.1 27.62,68.58 | R14.1 27.62,68.58 | 27.62,68.58 27.62,66.67 | 27.62,66.67 27.62,64.77 | 27.62,64.77 R8.1 | 8.1,66.67 8.1,68.58 R2.1 7.94,68.58 6.51,70.01 5.71,70.01 5.64,70.09 | 8.1,66.67 8.1,64.77 R5.1 | 5.64,70.09 5.56,70.01 3.17,70.01 JP1.5 | 5.64,70.09 7.94,72.39 C1.2 | 8.1,66.67 27.62,66.67 | v14.61,41.91 14.45,41.91 14.37,41.83
  Bottom 0.305: U$2.AGND 17.46,38.1 18.73,36.83 22.23,36.83 30.64,28.42 v30.64,26.67 30.64,25.08 31.59,24.13 32.86,24.13 v33.02,24.29 | v6.51,26.67 6.51,23.5 3.33,20.32 JP4.5 3.49,20.32 5.24,18.57 5.24,9.53 4.45,8.73 4.29,8.73 3.17,7.62 JP3.5 | v53.02,16.03 53.02,16.67 55.56,19.21 55.72,19.21 56.83,20.32 JP5.5 | U$1.4 U$1.3 | U$1.7 43.34,90.33 v43.34,83.82 43.66,83.82 54.61,72.87 54.61,71.91 56.52,70.01 56.83,70.01 JP2.5 | JP1.5 3.17,69.85 3.17,69.37 10.48,62.07 10.48,58.26 14.76,53.98 14.76,53.5 U$2.GND 14.76,53.34 14.61,53.18 v14.61,41.91
  pour Bottom: 1,99 59,99 59,1 1,1
  pour Top: 1,99 59,99 59,1 1,1
N$1  (via drill 0.35)
  Top 0.152: v12.86,60.01 17.78,60.01 18.89,58.9 R1.2 | v5.4,71.44 6.83,72.87 6.83,73.66 U1.3
  Bottom 0.152: v12.86,60.01 12.86,60.64 11.27,62.23 11.27,62.39 5.4,68.26 v5.4,71.44
N$2  (via drill 0.35)
  Top 0.152: v11.11,69.85 9.84,68.58 R2.2 | U1.2 v11.59,74.93 8.57,74.93 8.57,75.72 8.1,76.2 R3.1
  Bottom 0.152: v11.11,69.85 11.11,74.45 v11.59,74.93
N$3  (via drill 0.35)
  Top 0.152: v21.43,60.33 21.43,58.9 R4.2 | U1.5 v17.46,71.12
  Bottom 0.152: v21.43,60.33 21.43,65.41 20,66.83 20,68.58 v17.46,71.12
N$4  (via drill 0.35)
  Top 0.152: R6.1 10.48,64.77 | 10.48,64.77 R5.2 | v17.3,69.85 U1.6 | v13.81,62.39 11.27,62.39 10.48,63.18 10.48,64.77
  Bottom 0.152: v17.3,69.85 17.3,69.06 13.81,65.56 v13.81,62.39
N$5  (via drill 0.35)
  Top 0.152: v22.86,60.01 23.97,58.9 R7.2 | U1.10 v22.38,71.12
  Bottom 0.152: v22.86,60.01 22.86,64.93 21.27,66.52 21.27,70.17 22.23,71.12 v22.38,71.12
N$6  (via drill 0.35)
  Top 0.152: R8.2 v23.97,64.77 R9.1 | v22.38,69.85 U1.9
  Bottom 0.152: v22.38,69.85 22.38,66.36 v23.97,64.77
N$7  (via drill 0.35)
  Top 0.152: v25.4,60.01 26.51,58.9 R10.2 | U1.12 v23.5,73.66
  Bottom 0.152: v25.4,60.01 25.4,71.75 v23.5,73.66
N$8  (via drill 0.35)
  Top 0.152: v24.29,68.58 R11.2 | U1.13 v22.38,74.93 26.99,74.93 26.99,75.72 27.46,76.2 R12.1
  Bottom 0.152: v24.29,68.58 24.29,71.44 22.38,73.34 v22.38,74.93
N$9
  Top 0.152: U$1.9 42.86,92.39 41.12,92.39 38.73,90.01 D3.A
N$10
  Top 0.152: U$1.1 54.61,93.03 57.63,90.01 D5.C
  Bottom 0.152: U$1.1 U$1.2
N$11
  Top 0.152: FB3.1 49.21,90.01 53.98,90.01 D5.A
N$12
  Top 0.152: FB1.1 31.43,90.01 34.92,90.01 D3.C
N$13
  Bottom 0.152: JP_5V.1-BUS 23.81,91.44 23.97,91.28 39.21,91.28 U$1.11 U$1.12
N$14  (via drill 0.35)
  Top 0.152: C12.1 22.86,91.92 23.34,92.39 v24.29,92.39 25.56,92.39 26.04,92.87 IC1.3
  Bottom 0.152: v24.29,92.39 22.07,92.39 17.94,96.52 JP_5V.3-5V_VR
N$15
  Top 0.152: JP_5V.2-OUT FB2.1
N$16  (via drill 0.35)
  Top 0.152: v30.32,60.01 29.21,58.9 R13.2 | U2.3 v36.2,73.66
  Bottom 0.152: v30.32,60.01 30.32,67.79 v36.2,73.66
N$17  (via drill 0.35)
  Top 0.152: v45.56,61.91 42.39,61.91 39.37,58.9 R19.2 | v50.01,33.02 v55.4,33.02 | v30.96,17.78 v40.64,17.78 | v22.38,16.51 v28.57,16.51 | v18.26,12.06 17.62,12.7 U3.3
  Bottom 0.152: v45.56,61.91 45.56,59.85 55.4,50.01 v55.4,33.02 | v50.01,33.02 50.01,32.7 43.5,26.19 43.5,24.77 40.64,21.91 v40.64,17.78 | v30.96,17.78 29.84,17.78 v28.57,16.51 | v22.38,16.51 22.38,16.19 v18.26,12.06
N$18  (via drill 0.35)
  Top 0.152: v8.57,50.96 50.01,50.96 50.01,58.58 47.78,60.8 43.81,60.8 41.91,58.9 R20.2 | U3.5 v13.18,10.16
  Bottom 0.152: v8.57,50.96 8.57,36.99 12.06,33.5 12.06,25.72 16.83,20.95 16.83,20.32 17.62,19.53 19.53,19.53 20.32,18.73 20.32,17.3 v13.18,10.16
N$19
  Top 0.152: 12.06,13.97 12.06,12.06 12.38,11.75 12.38,11.11 12.06,10.79 12.06,9.84 9.84,7.62 R21.2 | U3.2 12.06,13.97 | 12.06,13.97 8.57,13.97 8.57,14.76 8.1,15.24 R22.1
N$20
  Top 0.152: R23.2 R24.1 13.18,3.81 13.18,7.94 13.81,8.57 14.76,8.57 15.08,8.89 U3.6
N$21  (via drill 0.35)
  Top 0.152: v9.68,52.07 49.21,52.07 49.21,58.42 47.62,60.01 45.56,60.01 44.45,58.9 R25.2 | U3.10 v23.5,10.16
  Bottom 0.152: v9.68,52.07 9.68,38.42 17.78,30.32 22.7,30.32 23.5,29.53 23.5,27.3 23.18,26.99 23.18,24.77 24.45,23.5 24.45,11.11 v23.5,10.16
N$22
  Top 0.152: R26.2 R27.1 22.38,3.81 22.38,7.94 21.75,8.57 20.8,8.57 20.48,8.89 U3.9
N$23  (via drill 0.35)
  Top 0.152: v45.56,55.88 45.56,57.78 46.04,58.26 46.35,58.26 46.83,58.74 R28.2 | v20.32,55.88 20.32,61.12 v9.37,61.12 | v13.34,32.07 v8.41,32.07 | U3.12 v23.34,12.7
  Bottom 0.152: v20.32,55.88 v45.56,55.88 | v9.37,61.12 9.37,53.18 6.35,50.16 6.35,34.13 v8.41,32.07 | v13.34,32.07 20.48,24.92 20.48,20.8 23.5,17.78 23.5,12.86 v23.34,12.7
N$24  (via drill 0.35)
  Top 0.152: v23.5,7.62 R29.2 | U3.13 v22.38,13.97 26.99,13.97 26.99,14.76 27.46,15.24 R30.1
  Bottom 0.152: v23.5,7.62 23.5,8.73 22.23,10 22.23,13.81 v22.38,13.97
N$25  (via drill 0.35)
  Top 0.152: v7.46,49.85 39.69,49.85 39.69,46.51 41.43,44.77 R31.2 | v9.05,34.29 16.67,34.29 17.46,33.5 17.46,27.94 U4.3
  Bottom 0.152: v7.46,49.85 7.46,35.88 v9.05,34.29
N$26  (via drill 0.35)
  Top 0.152: v11.27,22.86 R32.2 | U4.2 v10.95,29.21 8.57,29.21 8.57,30 8.1,30.48 R33.1
  Bottom 0.152: v11.27,22.86 11.27,23.65 10.95,23.97 v10.95,29.21
N$27
  Top 0.152: U4.5 5.4,25.4 5.4,38.1 16.35,49.05 38.89,49.05 38.89,44.77 R34.2
N$28
  Top 0.152: R35.2 R36.1 13.18,19.05 13.18,23.18 13.81,23.81 14.76,23.81 15.08,24.13 U4.6
N$29  (via drill 0.35)
  Top 0.152: v37.62,45.72 37.47,45.72 36.51,44.77 R37.2 | v44.61,42.86 47.78,39.69 48.26,39.69 49.21,38.73 49.21,37.47 48.9,37.47 48.26,36.83 v43.66,36.83 | v32.07,25.24 31.91,25.4 U4.10
  Bottom 0.152: v37.62,45.72 41.75,45.72 v44.61,42.86 | v43.66,36.83 43.18,36.83 32.07,25.72 v32.07,25.24
N$30  (via drill 0.35)
  Top 0.152: R38.2 23.34,19.05 | 23.34,19.05 R39.1 | v22.38,24.13 U4.9 | 23.34,19.05 v23.34,20.48
  Bottom 0.152: v22.38,24.13 23.5,23.02 23.5,20.64 v23.34,20.48
N$31  (via drill 0.35)
  Top 0.152: v13.18,27.94 6.83,27.94 6.83,38.58 16.51,48.26 30.32,48.26 33.81,44.77 R40.2 | v17.14,23.5 18.57,24.92 18.57,27.94 U4.12
  Bottom 0.152: v13.18,27.94 13.18,27.46 v17.14,23.5
N$32  (via drill 0.35)
  Top 0.152: v22.38,22.7 25.56,22.7 25.72,22.86 R41.2 | U4.13 v22.38,29.21 24.45,29.21 25.72,30.48 R42.1
  Bottom 0.152: v22.38,22.7 21.27,23.81 21.27,28.1 v22.38,29.21
N$33  (via drill 0.35)
  Top 0.152: v35.4,68.58 R14.2 | U2.2 v37.31,74.93 32.7,74.93 32.7,75.72 32.23,76.2 R15.1
  Bottom 0.152: v35.4,68.58 35.4,71.44 37.31,73.34 v37.31,74.93
N$34  (via drill 0.35)
  Top 0.152: v32.86,60.01 31.75,58.9 R16.2 | U2.5 v37.31,71.12
  Bottom 0.152: v32.86,60.01 32.86,64.61 37.31,69.06 v37.31,71.12
N$35
  Top 0.152: R17.2 R18.1 37.31,64.77 37.31,68.9 37.94,69.53 38.89,69.53 39.21,69.85 U2.6
N$36  (via drill 0.35)
  Top 0.152: v35.4,60.01 34.29,58.9 R43.2 | v42.39,70.8 42.7,71.12 U2.10
  Bottom 0.152: v35.4,60.01 35.4,62.39 42.39,69.37 v42.39,70.8
N$37
  Top 0.152: R44.2 R45.1 46.51,64.77 46.51,68.9 45.88,69.53 44.93,69.53 44.61,69.85 U2.9
N$38  (via drill 0.35)
  Top 0.152: v38.1,60.01 37.94,60.01 36.83,58.9 R46.2 | U2.12 v47.62,73.66
  Bottom 0.152: v38.1,60.01 41.27,60.01 49.53,68.26 49.53,71.75 v47.62,73.66
N$39  (via drill 0.35)
  Top 0.152: v48.42,68.58 R47.2 | U2.13 v46.51,74.93 51.12,74.93 51.12,75.72 51.59,76.2 R48.1
  Bottom 0.152: v48.42,68.58 48.42,71.44 46.51,73.34 v46.51,74.93
N$40  (via drill 0.35)
  Top 0.152: v29.84,46.83 29.84,46.2 31.27,44.77 R49.2 | U5.3 v29.53,27.94
  Bottom 0.152: v29.84,46.83 25.88,46.83 21.91,42.86 16.99,42.86 13.34,39.21 13.34,37.78 14.61,36.51 17.94,36.51 19.84,34.61 22.86,34.61 v29.53,27.94
N$41  (via drill 0.35)
  Top 0.152: v35.4,22.86 R50.2 | U5.2 v37.31,29.21 32.7,29.21 32.7,30 32.23,30.48 R51.1
  Bottom 0.152: v35.4,22.86 35.4,27.3 v37.31,29.21
N$42  (via drill 0.35)
  Top 0.152: v20.48,47.15 28.73,47.15 28.73,44.77 R52.2 | v45.88,44.77 v49.69,44.77 | v42.39,26.83 40.96,25.4 U5.5
  Bottom 0.152: v20.48,47.15 21.43,47.15 24.61,50.32 44.13,50.32 v49.69,44.77 | v45.88,44.77 45.88,43.97 50.8,39.05 50.8,37.15 43.5,29.84 43.5,27.94 v42.39,26.83
N$43
  Top 0.152: R53.2 R54.1 37.31,19.05 37.31,23.18 37.94,23.81 38.89,23.81 39.21,24.13 U5.6
N$44  (via drill 0.35)
  Top 0.152: v27.46,45.72 27.3,45.72 26.35,44.77 R55.2 | U5.10 v42.39,25.4
  Bottom 0.152: v27.46,45.72 36.2,45.72 37.31,46.83 42.07,46.83 50.01,38.89 50.01,37.31 42.7,30 42.7,28.57 41.27,27.15 41.27,26.51 v42.39,25.4
N$45
  Top 0.152: R56.2 R57.1 46.51,19.05 46.51,23.18 45.88,23.81 44.93,23.81 44.61,24.13 U5.9
N$46  (via drill 0.35)
  Top 0.152: v23.65,46.04 23.65,44.77 R58.2 | v50.8,40.48 51.59,39.69 53.34,39.69 54.13,38.89 54.13,37.47 51.12,37.47 45.09,31.43 43.18,31.43 42.7,30.96 42.7,27.94 U5.12
  Bottom 0.152: v23.65,46.04 24.13,46.04 26.04,47.94 44.13,47.94 48.9,43.18 48.9,42.23 50.64,40.48 v50.8,40.48
N$47  (via drill 0.35)
  Top 0.152: v47.62,22.86 R59.2 | U5.13 48.74,29.21 | 48.74,29.21 51.12,29.21 51.12,30 51.59,30.48 R60.1 | 48.74,29.21 v48.9,29.05
  Bottom 0.152: v47.62,22.86 47.62,23.34 48.42,24.13 48.42,28.57 v48.9,29.05
N$48  (via drill 0.35)
  Top 0.152: v21.27,46.04 21.27,44.77 R61.2 | v50.8,41.75 50.96,41.59 52.39,41.59 54.93,39.05 54.93,36.67 51.75,36.67 v51.12,36.04 | v41.91,18.41 42.86,17.46 v44.77,17.46 | U6.3 v41.43,12.7
  Bottom 0.152: v21.27,46.04 24.77,49.53 43.5,49.53 49.69,43.34 49.69,42.86 v50.8,41.75 | v51.12,36.04 51.12,32.7 47.62,29.21 47.62,24.29 41.91,18.57 v41.91,18.41 | v44.77,17.46 44.77,16.03 v41.43,12.7
N$49  (via drill 0.35)
  Top 0.152: v33.97,9.21 33.97,7.62 R62.2 | U6.2 v36.83,13.97 32.7,13.97 32.7,14.76 32.23,15.24 R63.1
  Bottom 0.152: v33.97,9.21 33.97,11.11 v36.83,13.97
N$50  (via drill 0.35)
  Top 0.152: v41.91,33.18 40.01,35.08 9.68,35.08 9.68,40.48 15.08,45.88 17.3,45.88 18.41,44.77 R64.2 | U6.5 v37.31,10.16
  Bottom 0.152: v41.91,33.18 41.91,28.73 39.53,26.35 39.53,12.38 v37.31,10.16
N$51
  Top 0.152: R65.2 R66.1 37.31,3.81 37.31,7.94 37.94,8.57 38.89,8.57 39.21,8.89 U6.6
N$52  (via drill 0.35)
  Top 0.152: v17.3,41.75 17.3,43.66 16.83,44.13 16.67,44.13 16.19,44.61 R67.2 | v41.43,11.27 42.55,10.16 U6.10
  Bottom 0.152: v17.3,41.75 46.2,41.75 49.21,38.73 49.21,37.78 45.72,34.29 41.59,34.29 38.73,31.43 38.73,13.02 36.2,10.48 36.2,9.84 36.99,9.05 39.21,9.05 v41.43,11.27
N$53
  Top 0.152: R68.2 R69.1 46.51,3.81 46.51,7.94 45.88,8.57 44.93,8.57 44.61,8.89 U6.9
N$54  (via drill 0.35)
  Top 0.152: v17.78,55.88 17.78,57.78 17.3,58.26 16.99,58.26 16.51,58.74 R70.2 | v50.8,43.18 51.59,42.39 52.55,42.39 55.72,39.21 55.72,35.56 v52.39,35.56 | v41.43,16.51 41.59,16.35 41.91,16.35 42.7,15.56 42.7,12.7 U6.12
  Bottom 0.152: v17.78,55.88 18.89,55.88 20,56.99 46.2,56.99 50.8,52.39 v50.8,43.18 | v52.39,35.56 52.39,28.73 49.21,25.56 49.21,23.02 45.56,19.37 44.29,19.37 v41.43,16.51
N$55  (via drill 0.35)
  Top 0.152: v48.42,7.62 R71.2 | U6.13 48.1,13.97 v48.42,13.65 49.53,12.54 51.59,12.54 51.59,15.24 R72.1
  Bottom 0.152: v48.42,13.65 v48.42,7.62